# Altium schematic sheet Snippet of Audio_Jack.SchDoc
size A4
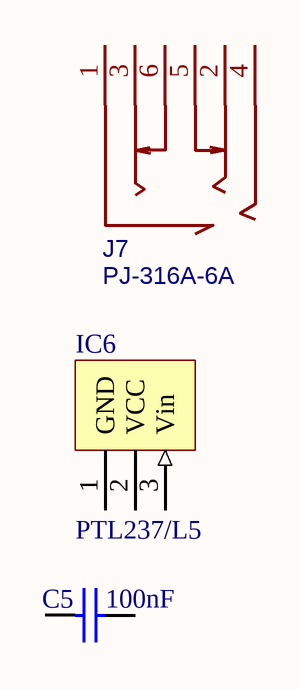
[diagram p0: Snippet of Audio_Jack.SchDoc]

## Parts
C5  100nF  [C_0603]
IC6  PTL237/L5  [PLT237/L5]
J7  PJ-316A-6A  [PJ-316A-6A]

## Nets

Not connected (* = marked no-connect by the designer): C5 1 2; IC6 1(GND) 2(VCC) 3(Vin); J7 1 2 3 4 5 6

## Library data of the parts
C5 = Cap_Chip: 贴片电容; 厂家型号: *; 商品编号: *
IC6 = Audio_PTL237/L5: 光纤发射模组
J7 = Audio_PJ-316A-6A: 3.5音频链接座子; BOM_Manufacturer: HRO; BOM_Manufacturer Part: PJ-316A-6A; BOM_Supplier Part: C128987; 厂家型号: *; 商品编号: *